# Altium schematic sheet BreakoutPcb.SchDoc
size A4
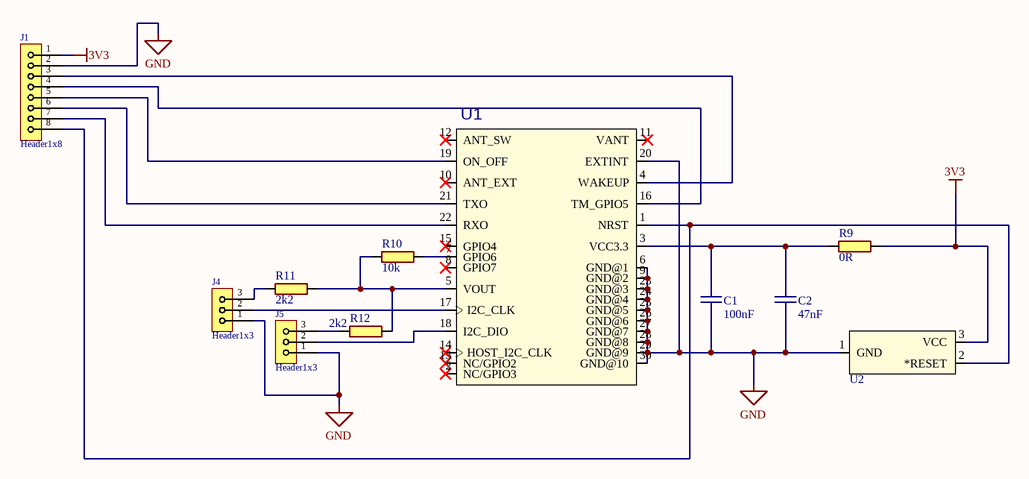
[diagram p0: BreakoutPcb.SchDoc]

## Parts
C1  100nF  [CAPC0603(1608)55_N]
C2  47nF  [CAPC0805(2012)100_N]
J1  Header1x8  [HDRV8W64P254_1X8_2032X254X900B]
J4  Header1x3  [HDRV3W64P254_1X3_762X254X900B]
J5  Header1x3  [HDRV3W64P254_1X3_762X254X900B]
R9  0R  [RESC0603(1608)_N]
R10  10k  [RESC0603(1608)_N]
R11  2k2  [RESC0603(1608)_N]
R12  2k2  [RESC0603(1608)_N]
U1  A2235-H  [XCVR_A2235-H]  (value not drawn)
U2  MAX809SEXR-T  [21-0075D]  (value not drawn)

## Nets
3V3: J1.1 R9.2 U2.3(VCC)
GND: C1.1 C2.1 J1.2 J4.1 J5.1 U1.6(GND@1) U1.9(GND@2) U1.20(EXTINT) U1.23(GND@3) U1.24(GND@4) U1.25(GND@5) U1.26(GND@6) U1.27(GND@7) U1.28(GND@8) U1.29(GND@9) U1.30(GND@10) U2.1(GND)
NetC1_2: C1.2 C2.2 R9.1 U1.3(VCC3.3)
NetJ1_3: J1.3 U1.4(WAKEUP)
NetJ1_4: J1.4 U1.16(TM_GPIO5)
NetJ1_5: J1.5 U1.19(ON_OFF)
NetJ1_6: J1.6 U1.21(TXO)
NetJ1_7: J1.7 U1.22(RXO)
NetJ1_8: J1.8 U1.1(NRST) U2.2(*RESET)
NetJ4_2: J4.2 U1.17(I2C_CLK)
NetJ4_3: J4.3 R11.1
NetJ5_2: J5.2 U1.18(I2C_DIO)
NetJ5_3: J5.3 R12.1
NetR10_1: R10.1 R11.2 R12.2 U1.5(VOUT)
NetR10_2: R10.2 U1.7(GPIO6)

Not connected (* = marked no-connect by the designer): U1 2(NC/GPIO3)* 8(GPIO7)* 10(ANT_EXT)* 11(VANT)* 12(ANT_SW)* 13(NC/GPIO2)* 14(HOST_I2C_CLK)* 15(GPIO4)*

## Library data of the parts
C1 = 3028: X7R 50V 5%; id: 3028; pakke_opprettet_av: 815; pakke_opprettet: 18.02.2015 14.18.13; symbol_opprettet: 14.11.2014 20.19.34; leverandor_varenr: 1759122; pris: 1; nokkelord: Kondensator, Capacitor, CAP; produsent: Multikomp; leverandor: Farnell; pakketype: 0603; symbol_opprettet_av: 815; navn: 100nF
C2 = 2446: X7R; id: 2446; pakke_opprettet_av: 815; pakke_opprettet: 14.11.2014 20.52.01; symbol_opprettet: 14.11.2014 20.19.34; pris: 1; nokkelord: Capacitor Cap Kondis; pakketype: 0805; symbol_opprettet_av: 815; navn: 47nF
J1 = 2435: id: 2435; pakke_opprettet_av: 815; pakke_opprettet: 13.11.2014 12.32.07; symbol_opprettet: 13.11.2014 11.00.45; beskrivelse: 2,54mm pitch; pris: 4; pakketype: TH; symbol_opprettet_av: 815; navn: Header 1x8
J4 J5 = 2430: id: 2430; pakke_opprettet_av: 815; pakke_opprettet: 13.11.2014 12.31.03; symbol_opprettet: 13.11.2014 10.59.05; beskrivelse: 2,54mm pitch; pris: 2; pakketype: TH; symbol_opprettet_av: 815; navn: Header 1x3
R9 = 3186: 0.1W 1% Thick film resistor; id: 3186; pakke_opprettet_av: 815; pakke_opprettet: 08.07.2014 21.15.30; symbol_opprettet: 08.07.2014 21.16.33; pris: 0; nokkelord: Resistor Motstand Jumper Lask; produsent: Multikomp; pakketype: 0603; symbol_opprettet_av: 815; navn: 0R
R10 = 2444: 0.1W 1% Thick film resistor; id: 2444; rad: -1; rom: OV; lager_type: Fremlager; dybde: 72; hylle: 6; antall: 100; kolonne: 0; pakke_opprettet_av: 815; pakke_opprettet: 08.07.2014 21.15.30; symbol_opprettet: 08.07.2014 21.16.33; leverandor_varenr: 2447230; nokkelord: Resistor Motstand; produsent: Multikomp; leverandor: Farnell; pakketype: 0603; symbol_opprettet_av: 815; navn: 10k; pris: 0
R11 R12 = 3449: 0.1W 1% Thick film resistor; id: 3449; rad: -1; rom: OV; lager_type: Fremlager; dybde: 56; hylle: 6; antall: 100; kolonne: 0; pakke_opprettet_av: 815; pakke_opprettet: 08.07.2014 21.15.30; symbol_opprettet: 08.07.2014 21.16.33; pakketype: 0603; symbol_opprettet_av: 815; navn: 2k2; pris: 0
U1 = A2235-H: Gps Module, Mini Outline w/ Ant; MF: Maestro Wireless; Availability: Good; Package: None; MP: A2235-H; Price: 16.06 USD; Value: *
U2 = MAX809SEXR-T: PMIC - system monitor Maxim Integrated MAX809SEXR+T Reset/power-on reset SC 70 3; Availability: Good; Package: SC-70-3 Maxim Integrated; MP: MAX809SEXR+T; Price: 2.42 USD; MF: Maxim Integrated; Value: *